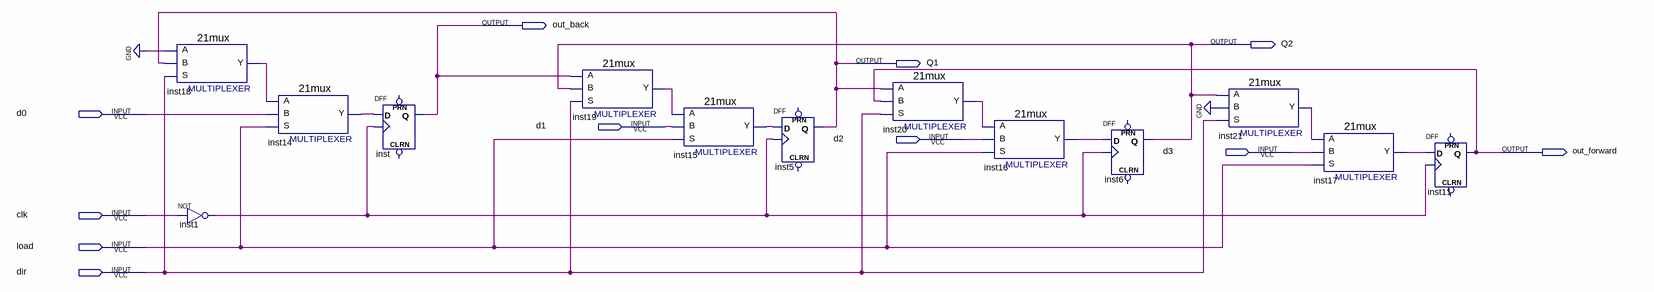
[diagram p0: schematic sheet]
// Quartus schematic Parallel_serial_reg_with_dir_choice.bdf as structural Verilog: 13 symbols, 11 pins
module Parallel_serial_reg_with_dir_choice (
  input  d0,
  input  d1,
  input  d2,
  input  d3,
  input  clk,
  input  load,
  input  dir,
  output out_back,
  output Q2,
  output Q1,
  output out_forward
);

  wire inst1_out, inst14_y, inst15_y, inst16_y, inst17_y, inst18_y, inst19_y, inst20_y, inst21_y;

  \21mux  inst18 (.S(dir), .B(Q1), .A(1'b0), .Y(inst18_y));
  not inst1 (inst1_out, clk);
  \21mux  inst14 (.S(load), .B(d0), .A(inst18_y), .Y(inst14_y));
  DFF inst (.CLK(inst1_out), .D(inst14_y), .Q(out_back));  // open: CLRN, PRN
  \21mux  inst19 (.S(dir), .B(Q2), .A(out_back), .Y(inst19_y));
  \21mux  inst15 (.S(load), .B(d1), .A(inst19_y), .Y(inst15_y));
  DFF inst5 (.CLK(inst1_out), .D(inst15_y), .Q(Q1));  // open: CLRN, PRN
  \21mux  inst20 (.S(dir), .B(out_forward), .A(Q1), .Y(inst20_y));
  \21mux  inst16 (.S(load), .B(d2), .A(inst20_y), .Y(inst16_y));
  DFF inst6 (.CLK(inst1_out), .D(inst16_y), .Q(Q2));  // open: CLRN, PRN
  \21mux  inst21 (.S(dir), .B(1'b0), .A(Q2), .Y(inst21_y));
  \21mux  inst17 (.S(load), .B(d3), .A(inst21_y), .Y(inst17_y));
  DFF inst11 (.CLK(inst1_out), .D(inst17_y), .Q(out_forward));  // open: CLRN, PRN
endmodule
